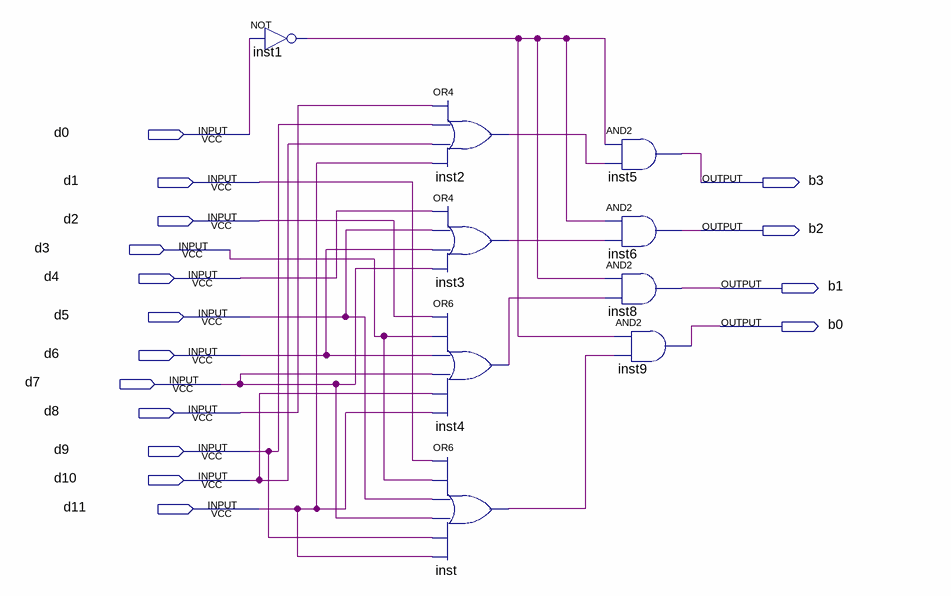
[diagram p0: schematic sheet]
// Quartus schematic dectobin.bdf as structural Verilog: 9 symbols, 16 pins
module dectobin (
  input  d0,
  input  d1,
  input  d2,
  input  d3,
  input  d4,
  input  d5,
  input  d6,
  input  d7,
  input  d8,
  input  d9,
  input  d10,
  input  d11,
  output b3,
  output b2,
  output b1,
  output b0
);

  wire inst1_out, inst2_out, inst3_out, inst4_out, inst_out;

  not inst1 (inst1_out, d0);
  or inst2 (inst2_out, d8, d9, d10, d11);
  or inst3 (inst3_out, d4, d5, d6, d7);
  or inst4 (inst4_out, d2, d3, d6, d7, d10, d11);
  or inst (inst_out, d1, d3, d5, d7, d9, d11);
  and inst5 (b3, inst1_out, inst2_out);
  and inst6 (b2, inst1_out, inst3_out);
  and inst8 (b1, inst1_out, inst4_out);
  and inst9 (b0, inst1_out, inst_out);
endmodule
